# EAGLE design 702_MAX6675_solder_station_v1 (EAGLE 9.6.2)
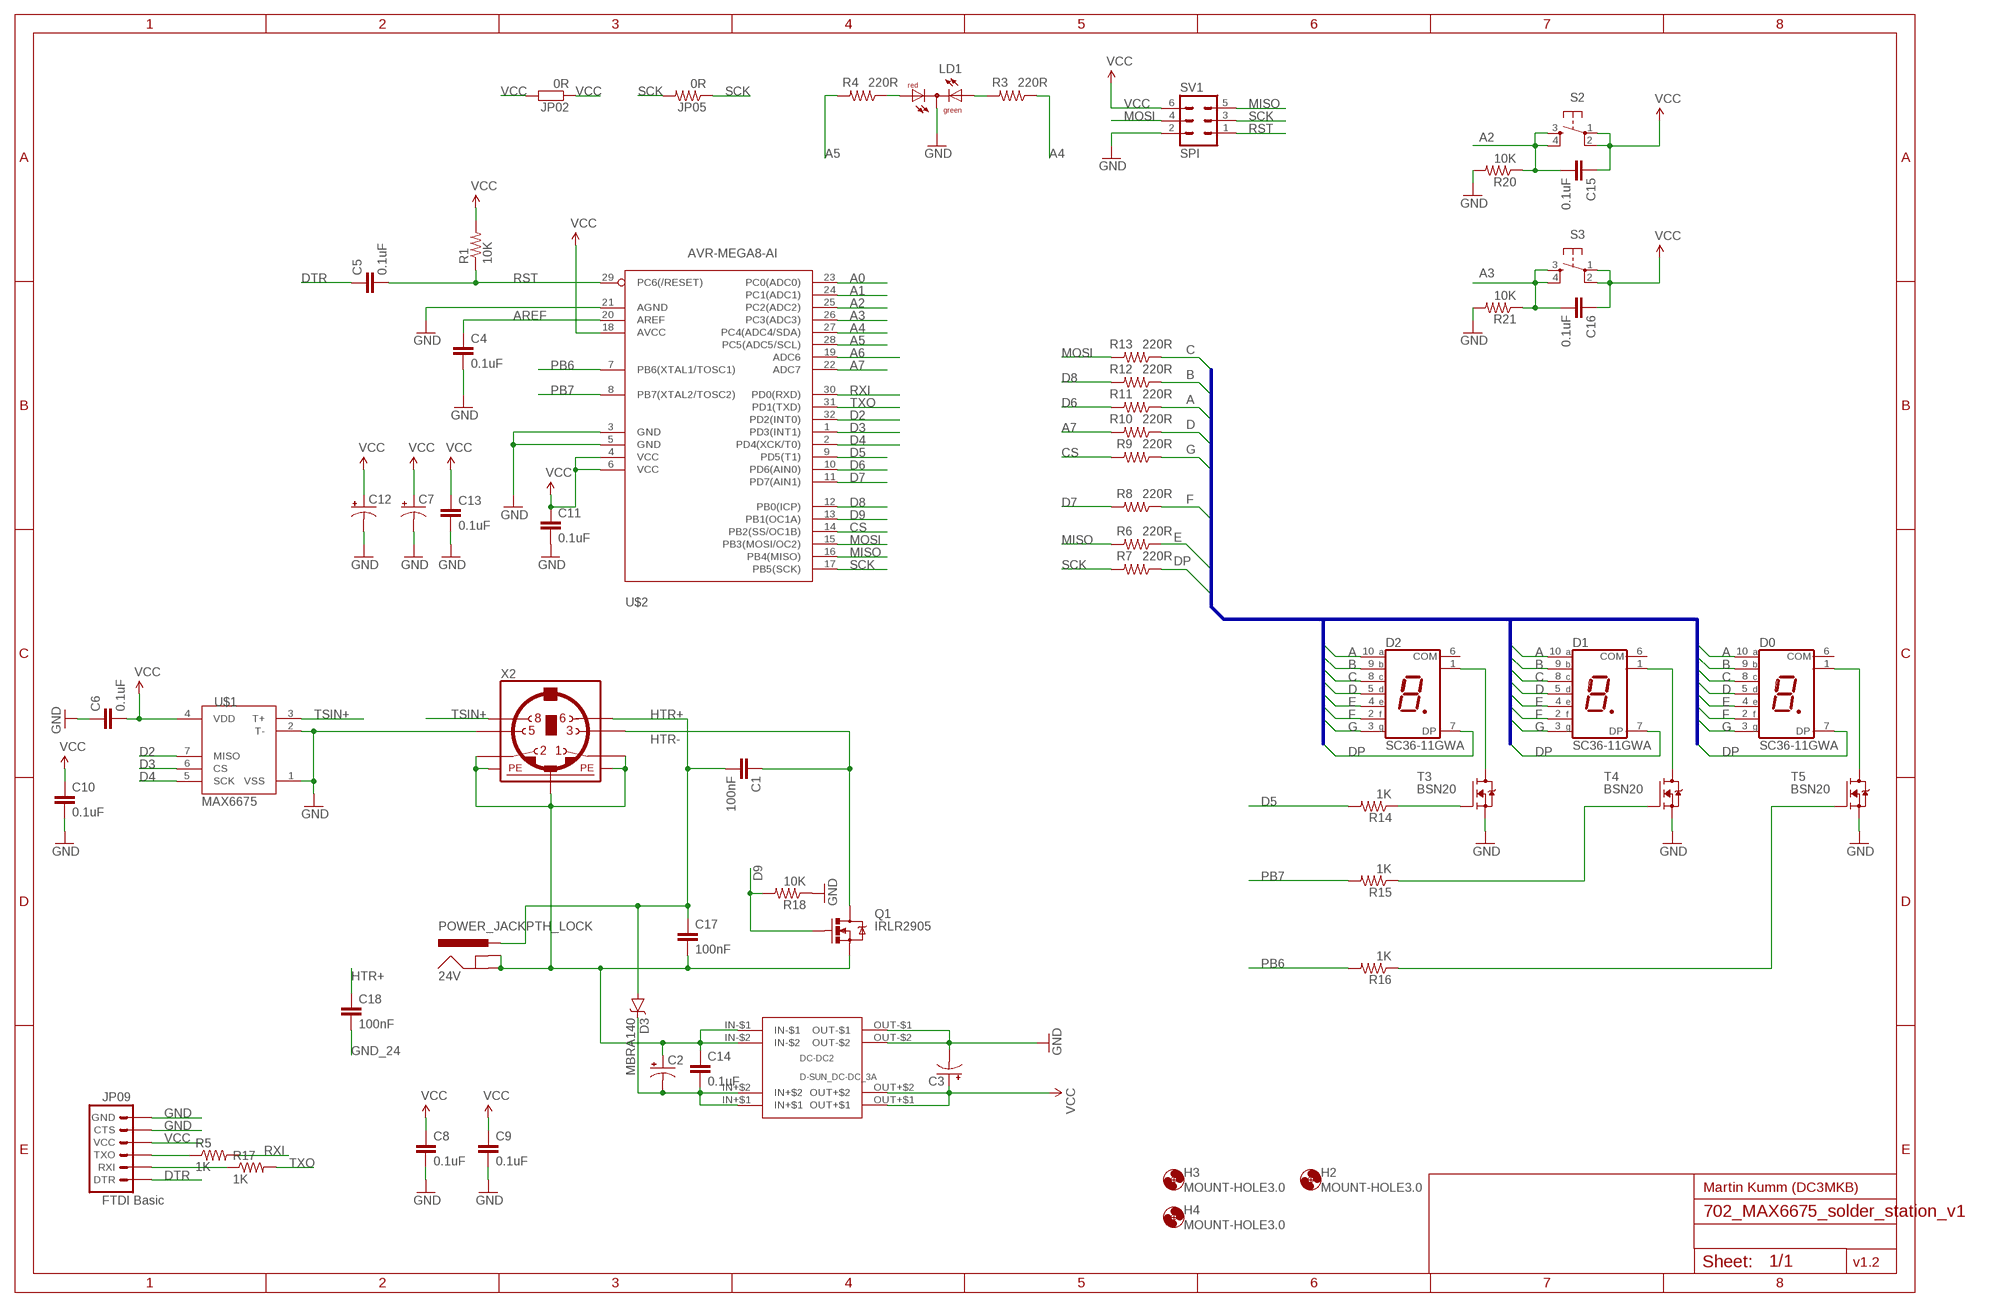
[diagram p0: schematic, sheet 1]

## Parts
24V  POWER_JACKPTH_LOCK  [POWER_JACK_PTH_LOCK]
C1  100nF  CAP1206  [1206]
C2  CAP_POLPTH1  [CPOL-RADIAL-100UF-25V]
C3  CAP_POLPTH1  [CPOL-RADIAL-100UF-25V]
C4  0.1uF  CAP0805  [0805]
C5  0.1uF  CAP0805  [0805]
C6  0.1uF  CAP0805  [0805]
C7  CAP_POL1206  [EIA3216]
C8  0.1uF  CAP0805  [0805]
C9  0.1uF  CAP0805  [0805]
C10  0.1uF  CAP0805  [0805]
C11  0.1uF  CAP0805  [0805]
C12  CAP_POL1206  [EIA3216]
C13  0.1uF  CAP0805  [0805]
C14  0.1uF  CAP1206  [1206]
C15  0.1uF  CAP0805  [0805]
C16  0.1uF  CAP0805  [0805]
C17  100nF  CAP1206  [1206]
C18  100nF  CAP1206  [1206]
D0  SC36-11GWA  SA36-11GWA  [SA36-11GWA]
D1  SC36-11GWA  SA36-11GWA  [SA36-11GWA]
D2  SC36-11GWA  SA36-11GWA  [SA36-11GWA]
D3  MBRA140  [SMA-DIODE]
DC-DC2  D-SUN_DC-DC_3A  [D-SUN_DC-DC_3A]
H2  MOUNT-HOLE3.0  [3,0]
H3  MOUNT-HOLE3.0  [3,0]
H4  MOUNT-HOLE3.0  [3,0]
JP02  0R  R-EU_R1206  [R1206]
JP05  0R  RESISTOR0805-RES  [0805]
JP09  FTDI Basic  ARDUINO_SERIAL_PROGRAMPTH  [1X06]
LD1  DUOLED-RG-C  [DUOLED-C-5MM]
Q1  IRLR2905  MOSFET-NCHANNELFDD8780  [DPAK]
R1  10K  RESISTOR0805-RES  [0805]
R3  220R  RESISTOR0805-RES  [0805]
R4  220R  RESISTOR0805-RES  [0805]
R5  1K  RESISTOR0805-RES  [0805]
R6  220R  RESISTOR0805-RES  [0805]
R7  220R  RESISTOR0805-RES  [0805]
R8  220R  RESISTOR0805-RES  [0805]
R9  220R  RESISTOR0805-RES  [0805]
R10  220R  RESISTOR0805-RES  [0805]
R11  220R  RESISTOR0805-RES  [0805]
R12  220R  RESISTOR0805-RES  [0805]
R13  220R  RESISTOR0805-RES  [0805]
R14  1K  RESISTOR0805-RES  [0805]
R15  1K  RESISTOR0805-RES  [0805]
R16  1K  RESISTOR0805-RES  [0805]
R17  1K  RESISTOR0805-RES  [0805]
R18  10K  RESISTOR0805-RES  [0805]
R20  10K  RESISTOR0805-RES  [0805]
R21  10K  RESISTOR0805-RES  [0805]
S2  TAC_SWITCHPTH  [TACTILE-PTH]
S3  TAC_SWITCHPTH  [TACTILE-PTH]
SV1  SPI  ML6  [ML6]
T3  BSN20  [SOT23]
T4  BSN20  [SOT23]
T5  BSN20  [SOT23]
U$1  MAX6675  [SO08-MAX6675]
U$2  AVR-MEGA8-AI  [TQFP32-08]
X2  MINI_DIN_6  [M_DIN6]

## Nets
A: D0.10(A) D1.10(A) D2.10(A) R11.1
A0: U$2.23(PC0(ADC0))
A1: U$2.24(PC1(ADC1))
A2: C15.2 R20.1 S2.3 S2.4 U$2.25(PC2(ADC2))
A3: C16.2 R21.1 S3.3 S3.4 U$2.26(PC3(ADC3))
A4: R3.1 U$2.27(PC4(ADC4/SDA))
A5: R4.2 U$2.28(PC5(ADC5/SCL))
A6: U$2.19(ADC6)
A7: R10.2 U$2.22(ADC7)
AREF: C4.1 U$2.20(AREF)
B: D0.9(B) D1.9(B) D2.9(B) R12.1
C: D0.8(C) D1.8(C) D2.8(C) R13.1
CS: R9.2 U$2.14(PB2(SS/OC1B))
D: D0.5(D) D1.5(D) D2.5(D) R10.1
D2: U$1.7(MISO) U$2.32(PD2(INT0))
D3: U$1.6(CS) U$2.1(PD3(INT1))
D4: U$1.5(SCK) U$2.2(PD4(XCK/T0))
D5: R14.2 U$2.9(PD5(T1))
D6: R11.2 U$2.10(PD6(AIN0))
D7: R8.2 U$2.11(PD7(AIN1))
D8: R12.2 U$2.12(PB0(ICP))
D9: Q1.1(G) R18.2 U$2.13(PB1(OC1A))
DP: D0.7(DP) D1.7(DP) D2.7(DP) R7.1
DTR: C5.1 JP09.1(DTR)
E: D0.4(E) D1.4(E) D2.4(E) R6.1
F: D0.2(F) D1.2(F) D2.2(F) R8.1
G: D0.3(G) D1.3(G) D2.3(G) R9.1
GND: C3.2(-) C4.2 C6.1 C7.C(-) C8.2 C9.2 C10.2 C11.2 C12.C(-) C13.2 DC-DC2.OUT-$1 DC-DC2.OUT-$2 JP09.5(CTS) JP09.6(GND) LD1.C R18.1 R20.2 R21.2 SV1.2 T3.2(S) T4.2(S) T5.2(S) U$1.1(VSS) U$1.2(T-) U$2.3(GND) U$2.5(GND) U$2.21(AGND) X2.5
GND_24: 24V.GND 24V.GNDBREAK C2.1(+) C14.1 C17.2 C18.2 DC-DC2.IN-$1 DC-DC2.IN-$2 Q1.3(S) X2.1 X2.2 X2.SH1(PE1) X2.SH2(PE2) X2.SH3(PE3)
HTR+: 24V.PWR C1.2 C17.1 C18.1 D3.A X2.6
HTR-: C1.1 Q1.4(D) X2.3
MISO: R6.2 SV1.5 U$2.16(PB4(MISO))
MOSI: R13.2 SV1.4 U$2.15(PB3(MOSI/OC2))
N$2: LD1.AR R4.1
N$3: LD1.AX(AG) R3.2
N$5: JP09.3(TXO) R5.1
N$6: D2.1(COM) T3.3(D)
N$7: D0.1(COM) T5.3(D)
N$8: JP09.2(RXI) R17.1
N$9: D1.1(COM) T4.3(D)
N$11: R14.1 T3.1(G)
N$12: R15.1 T4.1(G)
N$13: R16.1 T5.1(G)
N$27: C2.2(-) C14.2 D3.C DC-DC2.IN+$1 DC-DC2.IN+$2
PB6: R16.2 U$2.7(PB6(XTAL1/TOSC1))
PB7: R15.2 U$2.8(PB7(XTAL2/TOSC2))
RST: C5.2 R1.1 SV1.1 U$2.29(PC6(/RESET))
RXI: R5.2 U$2.30(PD0(RXD))
SCK: JP05.1 JP05.2 R7.2 SV1.3 U$2.17(PB5(SCK))
TSIN+: U$1.3(T+) X2.8
TXO: R17.2 U$2.31(PD1(TXD))
VCC: C3.1(+) C6.2 C7.A(+) C8.1 C9.1 C10.1 C11.1 C12.A(+) C13.1 C15.1 C16.1 DC-DC2.OUT+$1 DC-DC2.OUT+$2 JP02.1 JP02.2 JP09.4(VCC) R1.2 S2.1 S2.2 S3.1 S3.2 SV1.6 U$1.4(VDD) U$2.4(VCC) U$2.6(VCC) U$2.18(AVCC)
Unconnected: D0.6(COM) D1.6(COM) D2.6(COM)

## Buses
A,B,C
A,B,C,D,E,F,G,DP

## Notes on the sheet
- Martin Kumm (DC3MKB)
- v1.2

## Library data of the parts
24V = SparkFun-Connectors:POWER_JACK: Power Jack This is the standard 5.5mm barrel jack for power. The PTH is the most common, proven, reliable, footprint. The Slot footprint only works if the mill layer is transmitted to the PCB fab house so be warned. Mating wall wart : TOL-00298 (and others); PROD_ID: CONN-08197; SF_ID: PRT-00119
C1 C17 C18 = SparkFun-Passives:CAP: Capacitor Standard 0603 ceramic capacitor, and 0.1" leaded capacitor.
C2 C3 = SparkFun-Passives:CAP_POL: Capacitor Polarized These are standard SMD and PTH capacitors. Normally 10uF, 47uF, and 100uF in electrolytic and tantalum varieties. Always verify the external diameter of the through hole cap, it varies with capacity, voltage, and manufacturer. The EIA devices should be standard.
C4-C6 C8-C11 C13-C16 = SparkFun-Capacitors:CAP: Capacitor Standard 0603 ceramic capacitor, and 0.1" leaded capacitor.
C7 C12 = SparkFun-Capacitors:CAP_POL: Capacitor Polarized These are standard SMD and PTH capacitors. Normally 10uF, 47uF, and 100uF in electrolytic and tantalum varieties. Always verify the external diameter of the through hole cap, it varies with capacity, voltage, and manufacturer. The EIA devices should be standard.
D0 D1 D2 = 7seg_kingbright_SA36GWA:SA36-11GWA
D3 = SparkFun-DiscreteSemi:MBRA140: 40V, 1A Schottky rectifier SMA/DO-214AC package DIO-08053; PROD_ID: DIO-08053
DC-DC2 = MY:D-SUN_DC-DC_3A
H2-H4 = holes:MOUNT-HOLE: MOUNTING HOLE with drill center marker
JP02 = rcl:R-EU_: RESISTOR, European symbol
JP05 R1 R3-R18 R20 R21 = SparkFun-Passives:RESISTOR: Resistor Basic schematic elements and footprints for 0603, 1206, and PTH resistors.
JP09 = SparkFun-Connectors:ARDUINO_SERIAL_PROGRAM: FTDI connector footprints
LD1 = led:DUOLED-RG-C: DUO LED 2 colors (red/green), 5 mm, round, common Cathode www.ligitek.com or other producers.
Q1 = SparkFun-DiscreteSemi:MOSFET-NCHANNEL: Common NMOSFET Parts MFG P/N Store ID Prod ID FDD8780 TRANS-09984 SI7820DN TRANS-11055 FDS6630A IC-08089 2N7002PW TRANS-11151 FQP30N06L COM-10213 TRANS-10060 BSS123LT1G TRANS-08345 BSS138 TRANS-00830 BS170 2N7000; PROD_ID: TRANS-09984
S2 S3 = SparkFun-Retired:TAC_SWITCH: Momentary Switch Button commonly used for reset or general input. Spark Fun Electronics SKU : COM-00097 SMT- SWCH-08247
SV1 = con-ml:ML6: HARTING; OC_FARNELL: unknown; OC_NEWARK: unknown
T3-T5 = bsn20:BSN20
U$1 = SparkFun-AnalogIC:MAX6675: K-type thermocouple ADC, SPI output
U$2 = SparkFun-DigitalIC:AVR-MEGA8: MICROCONTROLLER 8 Kbytes FLASH 1 kbytes SRAM 512 bytes EEPROM USART 6-channel 10 bit ADC 2-channel 8 bit ADC
X2 = mini_din:MINI_DIN_6

## Board
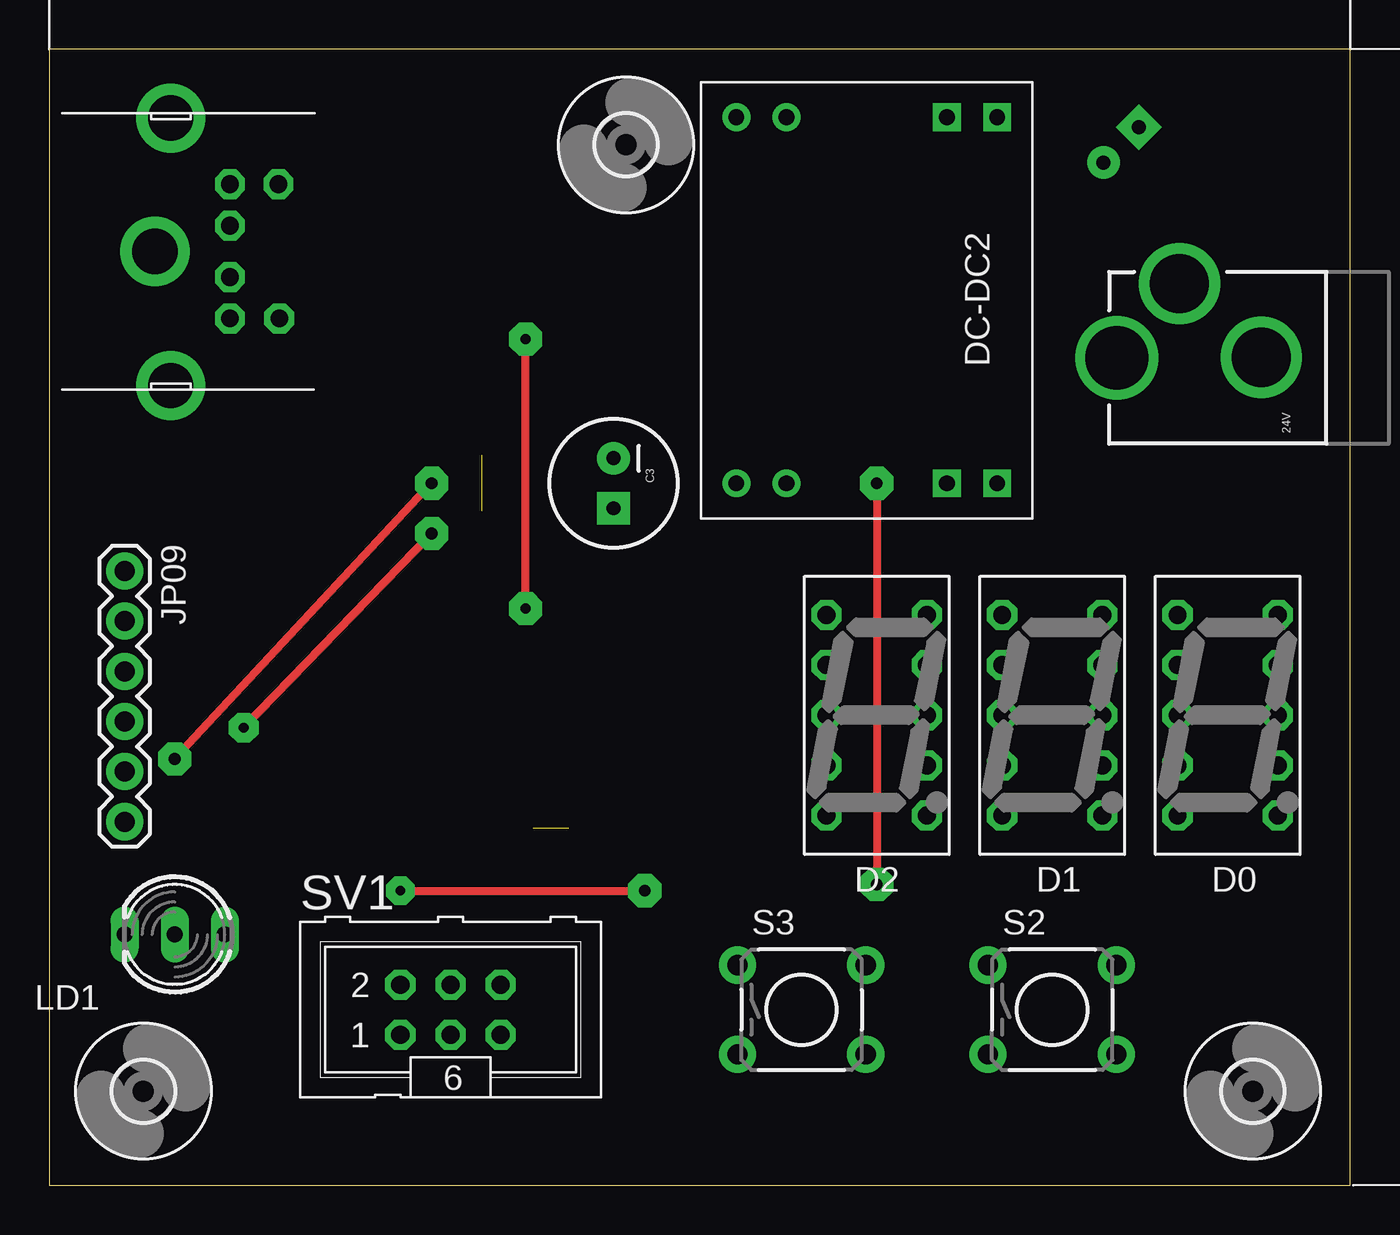
[diagram p1: board, top side]
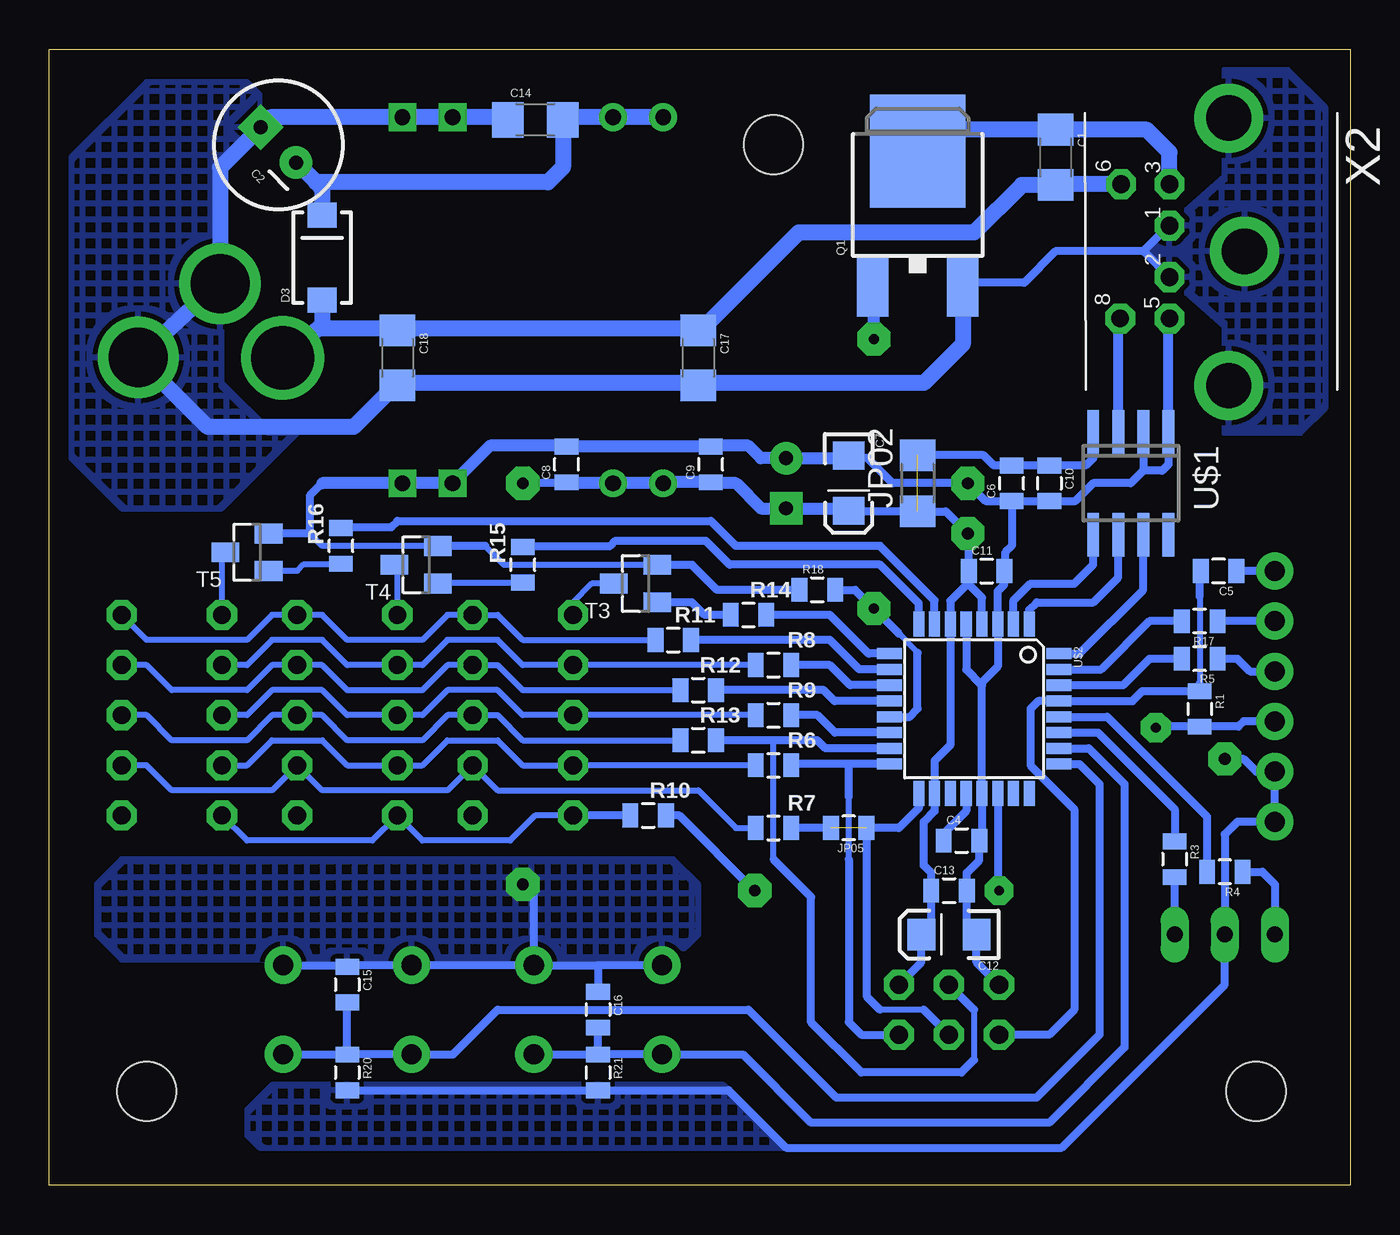
[diagram p2: board, bottom side, seen from below]

Size 65.89 x 57.54 mm. Coordinates in mm from the lower left corner, seen from the top.
Outline: 0,57.54 0,0 65.89,0 65.89,57.54 0,57.54
Copper layers (1*16): Top 0.035mm / dielectric 1.5mm / Bottom 0.035mm
Design rules "DFRobot_Eagle_Rule_v0.4 *": minimum track width 10mil, minimum drill 12mil, track to track 10mil, track to pad 8mil, pad to pad 8mil, via to via 10mil, smd to smd 0mil, copper to edge 10mil, drill to drill 10mil, minimum pad ring 12mil, minimum via ring 8mil, stop-mask expansion 2mil, vias tented up to drill 25mil, thermal gap 10mil

### Footprints (pad centres in the part's own frame; a part is rotated, then mirrored left to right if it is on the bottom)
POWER_JACK_PTH_LOCK = drill 2.997 pad 4.115: GND 0.025,6.557; GNDBREAK 3.762,10.7 | drill 3.2 pad 4.115: PWR 0,13.878
1206 = smd 1.6 x 1.8: 1 -1.4,0; 2 1.4,0
CPOL-RADIAL-100UF-25V = drill 0.7 pad 1.651 square: 1 1.27,0 | drill 0.7 pad 1.651: 2 -1.27,0
0805 = smd 0.8 x 1.2: 1 -0.9,0; 2 0.9,0
EIA3216 = smd 1.4 x 1.6: A 1.4,0; C -1.4,0
SA36-11GWA = drill 0.9 pad 1.524 octagon: 1 -3.81,5.715; 2 -3.81,3.175; 3 -3.81,0.635; 4 -3.81,-1.905; 5 -3.81,-4.445; 6 1.27,-4.445; 7 1.27,-1.905; 8 1.27,0.635; 9 1.27,3.175; 10 1.27,5.715
SMA-DIODE = smd 1.27 x 1.47: A -2.15,0; C 2.15,0
D-SUN_DC-DC_3A = drill 0.8: IN+$1 1.778,1.778; IN+$2 1.778,4.318; OUT+$1 20.32,1.778; OUT+$2 20.32,4.318 | drill 0.8 square: IN-$1 1.778,14.986; IN-$2 1.778,12.446; OUT-$1 20.32,14.986; OUT-$2 20.32,12.446
3,0 = hole 3: 0,0
R1206 = smd 1.6 x 1.803: 1 -1.422,0; 2 1.422,0
1X06 = drill 1.016 pad 1.88: 1 0,0; 2 2.54,0; 3 5.08,0; 4 7.62,0; 5 10.16,0; 6 12.7,0
DUOLED-C-5MM = drill 0.813 long: AR 2.54,0; AX -2.54,0; C 0,0
DPAK = smd 1.6 x 3: 1 -2.28,-5.31; 3 2.28,-5.31 | smd 4.826 x 5.715: 4 0,1.588
TACTILE-PTH = drill 1.016 pad 1.88: 1 -3.251,2.261; 2 3.251,2.261; 3 -3.251,-2.261; 4 3.251,-2.261
ML6 = drill 0.914 octagon: 1 -2.54,-1.27; 2 -2.54,1.27; 3 0,-1.27; 4 0,1.27; 5 2.54,-1.27; 6 2.54,1.27
SOT23 = smd 1 x 1.4: 1 -0.95,-1.1; 2 0.95,-1.1; 3 0,1.1
SO08-MAX6675 = smd 0.6 x 2.2: 1 -1.905,-2.6; 2 -0.635,-2.6; 3 0.635,-2.6; 4 1.905,-2.6; 5 1.905,2.6; 6 0.635,2.6; 7 -0.635,2.6; 8 -1.905,2.6
TQFP32-08 = smd 1.27 x 0.559: 1 -4.293,2.8; 2 -4.293,2; 3 -4.293,1.2; 4 -4.293,0.4; 5 -4.293,-0.4; 6 -4.293,-1.2; 7 -4.293,-2; 8 -4.293,-2.8; 17 4.293,-2.8; 18 4.293,-2; 19 4.293,-1.2; 20 4.293,-0.4; 21 4.293,0.4; 22 4.293,1.2; 23 4.293,2; 24 4.293,2.8 | smd 0.559 x 1.27: 9 -2.8,-4.293; 10 -2,-4.293; 11 -1.2,-4.293; 12 -0.4,-4.293; 13 0.4,-4.293; 14 1.2,-4.293; 15 2,-4.293; 16 2.8,-4.293; 25 2.8,4.293; 26 2,4.293; 27 1.2,4.293; 28 0.4,4.293; 29 -0.4,4.293; 30 -1.2,4.293; 31 -2,4.293; 32 -2.8,4.293
M_DIN6 = drill 0.9 pad 1.422 octagon: 1 -1.3,-3.75; 2 1.3,-3.75; 3 -3.4,-3.75; 5 3.4,-3.75; 6 -3.4,-6.2; 8 3.4,-6.25 | drill 2.3 pad 3.5: SH1 6.8,-0.75; SH2 0,0.05; SH3 -6.75,-0.75

### Placement (x,y rotation side)
24V  67.94,41.91 90 top
C1  14.92,52.07 270 bottom
C2  54.29,52.7 135 bottom
C3  28.57,35.56 270 top
C4  19.68,17.46 0 bottom
C5  6.67,31.12 180 bottom
C6  17.14,35.56 90 bottom
C7  25.4,35.56 270 bottom
C8  39.69,36.51 90 bottom
C9  32.38,36.51 90 bottom
C10  15.24,35.56 270 bottom
C11  18.41,31.12 0 bottom
C12  20.32,12.7 180 bottom
C13  20.32,14.92 0 bottom
C14  41.27,53.98 0 bottom
C15  50.8,10.16 270 bottom
C16  38.1,8.89 270 bottom
C17  33.02,41.91 270 bottom
C18  48.26,41.91 270 bottom
D0  60.96,23.18 0 top
D1  52.07,23.18 0 top
D2  43.18,23.18 0 top
D3  52.07,46.99 90 bottom
DC-DC2  33.02,55.88 270 top
H2  29.21,52.7 0 top
H3  4.76,4.76 0 top
H4  60.96,4.76 0 top
JP02  21.91,35.56 90 bottom
JP05  25.4,18.1 180 bottom
JP09  3.81,31.12 270 top
LD1  6.35,12.7 180 top
Q1  21.91,50.8 0 bottom
R1  7.62,24.13 270 bottom
R3  8.89,16.51 270 bottom
R4  6.35,15.88 180 bottom
R5  7.62,26.67 180 bottom
R6  29.21,21.27 0 bottom
R7  29.21,18.1 0 bottom
R8  29.21,26.35 0 bottom
R9  29.21,23.81 0 bottom
R10  35.56,18.73 0 bottom
R11  34.29,27.62 0 bottom
R12  33.02,25.08 0 bottom
R13  33.02,22.54 0 bottom
R14  30.48,28.89 0 bottom
R15  41.91,31.43 90 bottom
R16  51.12,32.38 90 bottom
R17  7.62,28.57 180 bottom
R18  26.99,30.16 0 bottom
R20  50.8,5.71 270 bottom
R21  38.1,5.71 270 bottom
S2  50.8,8.89 0 top
S3  38.1,8.89 0 top
SV1  20.32,8.89 0 top
T3  36.2,30.48 90 bottom
T4  47.31,31.43 90 bottom
T5  55.88,32.07 90 bottom
U$1  11.11,35.56 180 bottom
U$2  19.05,24.13 270 bottom
X2  5.4,47.31 270 bottom

### Tracks (layer width: path | path; a pad name or v marks a point on that pad's centre or on a via)
A
  Bottom 0.305: D0.10 60.96,27.62 55.88,27.62 54.61,28.89 D1.10 52.07,28.89 50.8,27.62 46.99,27.62 45.72,28.89 D2.10 43.18,28.89 41.91,27.62 R11.1
A2
  Bottom 0.406: U$2.25 13.71,21.33 12.7,20.32 12.7,7.62 15.88,4.45 26.04,4.45 30.48,8.89 43.18,8.89 45.44,6.63 S2.3 50.79,6.63 R20.1 | R20.1 C15.2 | S2.4 50.81,6.63 R20.1
A3
  Bottom 0.406: U$2.26 13.24,22.13 11.43,20.32 11.43,6.99 15.24,3.18 27.3,3.18 30.76,6.63 S3.3 38.09,6.63 R21.1 | R21.1 C16.2 | S3.4 38.11,6.63 R21.1
A4
  Bottom 0.406: U$2.27 12.77,22.93 8.89,19.05 R3.1
A5
  Bottom 0.406: U$2.28 12.3,23.73 7.25,18.68 R4.2
A7  (via drill 0.5 pad 1.42, 0.6 pad 1.68)
  Top 0.406: v17.78,14.92 v30.16,14.92
  Bottom 0.406: v17.78,14.92 17.85,14.99 U$2.22 | v30.16,14.92 33.97,18.73 R10.2
AREF
  Bottom 0.406: U$2.20 19.45,18.97 20.59,17.83 C4.1
B
  Bottom 0.305: D0.9 60.96,26.35 59.69,25.08 55.88,25.08 54.61,26.35 D1.9 52.07,26.35 50.8,25.08 46.99,25.08 45.72,26.35 D2.9 43.18,26.35 41.91,25.08 R12.1
C
  Bottom 0.305: D0.8 60.96,23.81 59.69,22.54 55.88,22.54 54.61,23.81 D1.8 52.07,23.81 50.8,22.54 46.99,22.54 45.72,23.81 D2.8 43.18,23.81 41.91,22.54 R13.1
CS
  Bottom 0.406: U$2.14 26.11,22.93 26.99,23.81 R9.2
D
  Bottom 0.305: D2.5 41.27,18.73 42.55,17.46 46.99,17.46 D1.5 49.53,17.46 55.88,17.46 D0.5
  Bottom 0.406: R10.1 D2.5
D2
  Bottom 0.406: U$2.32 13.71,26.93 10.48,30.16 U$1.7
D3
  Bottom 0.406: U$2.1 16.25,29.15 15.88,29.53 13.02,29.53 11.75,30.8 U$1.6
D4
  Bottom 0.406: U$2.2 17.05,29.62 16.19,30.48 13.97,30.48 13.02,31.43 U$1.5
D5
  Bottom 0.406: U$2.9 24.39,26.93 26.35,28.89 R14.2
D6
  Bottom 0.406: U$2.10 24.86,26.13 26.35,27.62 R11.2
D7
  Bottom 0.406: U$2.11 25.33,25.33 26.35,26.35 R8.2
D8
  Bottom 0.406: U$2.12 26.12,24.53 26.67,25.08 R12.2
D9  (via drill 0.5 pad 1.68)
  Top 0.406: v24.13,29.21 v24.13,42.86
  Bottom 0.305: 21.91,26.99 22.86,27.94
  Bottom 0.406: U$2.13 22.31,23.73 21.91,24.13 21.91,26.99 | 22.86,27.94 v24.13,29.21 25.08,30.16 R18.2
  Bottom 0.61: v24.13,42.86 24.13,45.43 Q1.1
DP
  Bottom 0.305: D0.7 60.96,21.27 59.69,20 54.61,20 D1.7 52.07,20 45.72,20 D2.7 43.18,20 33.02,20 31.11,18.1 R7.1
DTR
  Bottom 0.406: JP09.1 C5.1
E
  Bottom 0.305: D0.4 55.88,21.27 54.61,22.54 52.07,22.54 50.8,21.27 D1.4 46.99,21.27 45.72,22.54 43.18,22.54 41.91,21.27 D2.4 R6.1
F
  Bottom 0.305: D0.2 55.88,26.35 54.61,27.62 52.07,27.62 50.8,26.35 D1.2 46.99,26.35 45.72,27.62 43.18,27.62 41.91,26.35 D2.2 R8.1
G
  Bottom 0.305: D0.3 55.88,23.81 54.61,25.08 52.07,25.08 50.8,23.81 D1.3 46.99,23.81 45.72,25.08 43.18,25.08 41.91,23.81 D2.3 R9.1
GND  (via drill 0.6 pad 1.68)
  Top 0.406: v6.35,21.59 v19.37,35.56
  Bottom 0.305: T3.2 42.86,31.43 43.81,32.38 | T4.2 52.07,32.38 52.7,33.02
  Bottom 0.406: 18.73,25.4 17.85,26.28 U$2.3 17.85,30.09 17.52,30.43 C11.2 17.46,31.17 17.46,32.07 17.14,32.38 C6.1 | 18.73,19.92 U$2.21 | U$2.5 19.45,26.12 18.73,25.4 | U$2.21 18.65,25.32 18.73,25.4 | 9.21,43.85 X2.5 | U$1.1 9.21,36.51 9.53,36.2 10.48,36.2 | 10.48,36.2 11.11,35.56 13.02,35.56 13.92,34.66 C10.2 C6.1 | U$1.2 10.48,36.2 | SV1.2 18.92,11.3 C12.C | 43.81,32.38 T4.2 | T5.2 52.7,33.02 52.7,34.92 52.07,35.56 | U$2.21 18.65,17.6 C4.2 18.79,16.46 19.42,15.82 C13.2 19.42,13.2 C12.C | 18.73,12.89 C12.C | R18.1 32.07,30.16 33.34,31.43 T3.2 | v6.35,21.59 5.4,21.59 4.76,20.95 JP09.5 JP09.6 5.71,18.41 6.35,17.78 LD1.C 6.35,10.16 14.61,1.91 28.57,1.91 31.48,4.81 R21.2 R20.2 | C7.C 25.27,36.83 24.45,36.83 23.18,35.56 v19.37,35.56 18.47,34.66 C6.1 | C8.2 39.42,37.41 39.37,37.46
  Bottom 0.5: U$1.1 9.21,43.85
  Bottom 0.61: 39.37,37.46 43.56,37.46 DC-DC2.OUT-$2 DC-DC2.OUT-$1 52.07,35.56 | C7.C 25.4,36.83 C3.2 29.84,36.83 30.48,37.46 32.38,37.46 C9.2 C8.2
  pour Bottom (hatched): 28.57,1.91 31.75,5.08 54.61,5.08 55.88,3.81 55.88,2.54 55.24,1.91
GND_24
  Bottom 0.305: C18.2 48.26,40.64
  Bottom 0.406: 42.67,54.1 C14.1 | X2.1 9.18,48.61 10.48,47.31 | 10.48,47.31 10.45,47.31 X2.2 | 10.48,47.31 14.92,47.31 16.51,45.72 19.4,45.72 Q1.3
  Bottom 0.813: Q1.3 19.63,42.6 21.59,40.64 33.02,40.64 | 33.02,40.64 48.26,40.64 50.48,38.42 57.87,38.42 24V.GND 57.33,45.67 24V.GNDBREAK 57.24,51.55 C2.1 54.69,54.1 DC-DC2.IN-$1 DC-DC2.IN-$2 42.8,54.1 C14.1 | C17.2 33.02,40.64
  pour Bottom (hatched): 6.35,38.1 6.35,43.5 9.21,46.04 10.48,47.31 9.21,48.58 6.35,51.12 6.35,56.52 3.17,56.52 1.27,54.61 1.27,39.37 2.54,38.1
  pour Bottom (hatched): 55.24,53.66 55.24,55.24 55.88,55.88 60.96,55.88 64.77,52.07 64.77,36.83 62.23,34.29 57.15,34.29 53.34,38.1 54.61,38.1 57.15,40.64 57.15,51.75
HTR+
  Bottom 0.305: C18.1 48.26,43.38
  Bottom 0.406: 14.88,50.71 C1.2
  Bottom 0.813: X2.6 14.88,50.71 | D3.A 52.07,43.59 52.27,43.38 | 52.27,43.38 24V.PWR | C1.2 16.64,50.67 19.05,48.26 27.94,48.26 32.81,43.38 33.02,43.38 | 33.02,43.38 48.26,43.38 52.27,43.38 | C17.1 33.02,43.38
HTR-
  Bottom 0.406: 14.79,53.34 C1.1
  Bottom 0.61: 20.83,53.47 Q1.4
  Bottom 0.813: 20.83,53.47 C1.1 10.29,53.47 9.15,52.33 X2.3
MISO
  Bottom 0.305: 25.4,16.51 25.4,19.69
  Bottom 0.406: SV1.5 24.77,7.62 25.4,8.26 25.4,16.51 | U$2.16 25.4,21.33 | 25.4,21.33 28.31,21.33 R6.2 | 25.4,19.69 25.4,21.33
MOSI
  Bottom 0.305: 19.05,8.89 19.05,6.35 | 29.21,16.51 29.21,22.54
  Bottom 0.406: SV1.4 19.05,8.89 | 19.05,6.35 19.68,5.71 24.77,5.71 27.3,8.26 27.3,14.6 29.21,16.51 | U$2.15 26.57,22.13 26.99,22.54 29.21,22.54 R13.2
N$2
  Bottom 0.406: R4.1 4.45,15.88 3.81,15.24 LD1.AR
N$3
  Bottom 0.406: LD1.AX R3.2
N$5
  Bottom 0.406: JP09.3 5.08,26.03 5.71,26.67 R5.1
N$6
  Bottom 0.305: T3.3 38.42,30.48 39.37,29.53 D2.1
N$7
  Bottom 0.305: T5.3 57.15,31.9 D0.1
N$8
  Bottom 0.406: JP09.2 R17.1
N$9
  Bottom 0.305: D1.1 48.26,31.28 T4.3
N$11
  Bottom 0.406: R14.1 32.7,28.89 33.34,29.53 T3.1
N$12
  Bottom 0.305: T4.1 46.16,30.53 R15.1
N$13
  Bottom 0.305: R16.1 51.17,31.43 53.02,31.43 53.34,31.12 T5.1
N$27
  Bottom 0.813: C2.2 52.39,50.8 | 52.39,50.8 52.07,50.48 D3.C | 52.39,50.8 40.64,50.8 39.88,51.56 C14.2 39.88,54.1 DC-DC2.IN+$2 DC-DC2.IN+$1
PB6
  Bottom 0.305: R16.2 51.06,33.34
  Bottom 0.406: U$2.7 21.05,29.62 23.81,32.38 31.11,32.38 32.38,33.66 48.26,33.66 48.58,33.34 51.06,33.34
PB7
  Bottom 0.305: R15.2 41.86,32.38
  Bottom 0.406: U$2.8 21.85,29.47 23.81,31.43 31.43,31.43 32.65,32.65 37.2,32.65 37.47,32.38 41.86,32.38
RST
  Bottom 0.305: 7.62,29.84 7.62,25.4
  Bottom 0.406: 7.62,29.84 7.62,30.43 C5.2 | 7.62,25.4 R1.1 10.53,25.03 11.03,24.53 U$2.29 15.79,24.53 16.19,24.13 16.19,21.27 13.97,19.05 13.97,8.89 15.24,7.62 SV1.1
RXI
  Bottom 0.406: U$2.30 11.5,25.33 10.16,26.67 R5.2
SCK  (1 unrouted)
  Bottom 0.305: 21.59,8.89 23.81,8.89
  Bottom 0.406: SV1.3 21.59,8.89 | JP05.2 R7.2 | U$2.17 21.85,19.11 22.86,18.1 JP05.1 24.5,9.58 23.81,8.89
TSIN+
  Bottom 0.406: 11.75,43.81 X2.8
  Bottom 0.5: U$1.3 11.75,43.81
TXO
  Bottom 0.406: U$2.31 12.61,26.13 10.16,28.57 R17.2
VCC  (via drill 0.5 pad 1.5, 0.6 pad 1.68)  (1 unrouted)
  Top 0.406: v9.84,23.18 v19.37,33.02 | v41.91,35.56 v41.91,15.24
  Bottom 0.406: U$2.4 18.65,29.76 19.37,30.48 | 19.37,30.48 20.25,29.6 U$2.6 20.25,22.3 21.05,21.49 U$2.18 21.05,18.95 21.59,18.41 21.59,16.19 21.22,15.82 C13.1 21.22,13.2 C12.A | 19.37,30.48 19.32,30.48 C11.1 19.32,32.97 v19.37,33.02 20.48,34.14 JP02.1 21.93,34.16 C7.A | U$1.4 13.02,36.83 13.39,36.46 C10.1 C6.2 18.05,36.46 18.57,36.98 JP02.2 | SV1.6 21.72,11.3 C12.A | 21.59,12.83 C12.A | JP09.4 5.4,23.49 5.66,23.23 R1.2 9.53,23.23 v9.84,23.18 | 50.89,11.15 C15.1 | 50.71,11.15 C15.1 | 34.92,11.39 S3.1 38.1,11.15 | 50.8,11.15 S2.1 S3.2 | S2.2 50.8,11.15 | 50.8,11.15 C15.1 | S3.2 38.1,11.15 | 38.1,11.15 C16.1 | v41.91,35.56 39.37,35.56 39.42,35.61 C8.1 | v41.91,15.24 41.35,14.68 S3.2
  Bottom 0.61: C7.A 25.4,34.29 C3.1 29.84,34.29 31.11,35.56 32.38,35.56 C9.1 34.74,35.61 DC-DC2.OUT+$1 DC-DC2.OUT+$2 39.63,35.56 C8.1
  pour Bottom (hatched): 34.29,11.43 33.02,12.7 33.02,15.24 34.29,16.51 62.23,16.51 63.5,15.24 63.5,12.7 62.23,11.43